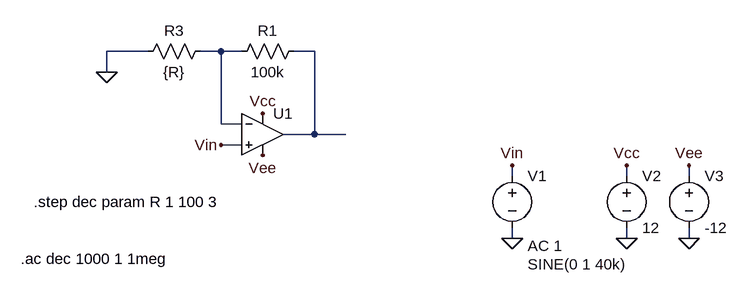
[diagram p0: schematic Draft1.asc]
Draft1.asc, the LTspice schematic file:
Version 4
SHEET 1 1028 680
WIRE 128 0 64 0
WIRE 240 0 208 0
WIRE 272 0 240 0
WIRE 384 0 352 0
WIRE 64 32 64 0
WIRE 240 112 240 0
WIRE 272 112 240 112
WIRE 384 128 384 0
WIRE 384 128 336 128
WIRE 432 128 384 128
WIRE 272 144 240 144
WIRE 688 192 688 176
WIRE 864 192 864 176
WIRE 960 192 960 176
WIRE 688 288 688 272
WIRE 864 288 864 272
WIRE 960 288 960 272
FLAG 688 288 0
FLAG 688 176 Vin
FLAG 864 288 0
FLAG 864 176 Vcc
FLAG 304 96 Vcc
FLAG 240 144 Vin
FLAG 64 32 0
FLAG 304 160 Vee
FLAG 960 288 0
FLAG 960 176 Vee
SYMBOL voltage 688 176 R0
WINDOW 3 24 152 Left 2
WINDOW 123 24 124 Left 2
WINDOW 39 0 0 Left 0
SYMATTR InstName V1
SYMATTR Value SINE(0 1 40k)
SYMATTR Value2 AC 1
SYMBOL OpAmps\\UniversalOpAmp 304 128 R0
SYMATTR InstName U1
SYMATTR Value2 Avol=100k GBW=2.8Meg Vos=0
SYMBOL voltage 864 176 R0
WINDOW 123 0 0 Left 0
WINDOW 39 0 0 Left 0
SYMATTR InstName V2
SYMATTR Value 12
SYMBOL res 368 -16 R90
WINDOW 0 0 56 VBottom 2
WINDOW 3 32 56 VTop 2
SYMATTR InstName R1
SYMATTR Value 100k
SYMBOL res 224 -16 R90
WINDOW 0 0 56 VBottom 2
WINDOW 3 32 56 VTop 2
SYMATTR InstName R3
SYMATTR Value {R}
SYMBOL voltage 960 176 R0
WINDOW 123 0 0 Left 0
WINDOW 39 0 0 Left 0
SYMATTR InstName V3
SYMATTR Value -12
TEXT -68 320 Left 2 !.ac dec 1000 1 1meg
TEXT -48 232 Left 2 !.step dec param R 1 100 3

The netlist it stands for:
* Draft1.asc
V1 Vin 0 SINE(0 1 40k) AC 1
XU1 Vin N001 Vcc Vee N002 level1 Avol=100k GBW=2.8Meg Vos=0 En=0 Enk=0 In=0 Ink=0 Rin=500Meg  ; pins In+ In- V+ V- OUT
V2 Vcc 0 12
R1 N002 N001 100k
R3 N001 0 {R}
V3 Vee 0 -12
.ac dec 1000 1 1meg
.step dec param R 1 100 3
.lib UniversalOpAmp1.lib
.backanno
.end